# Altium schematic sheet Sheet1.SchDoc
size A2
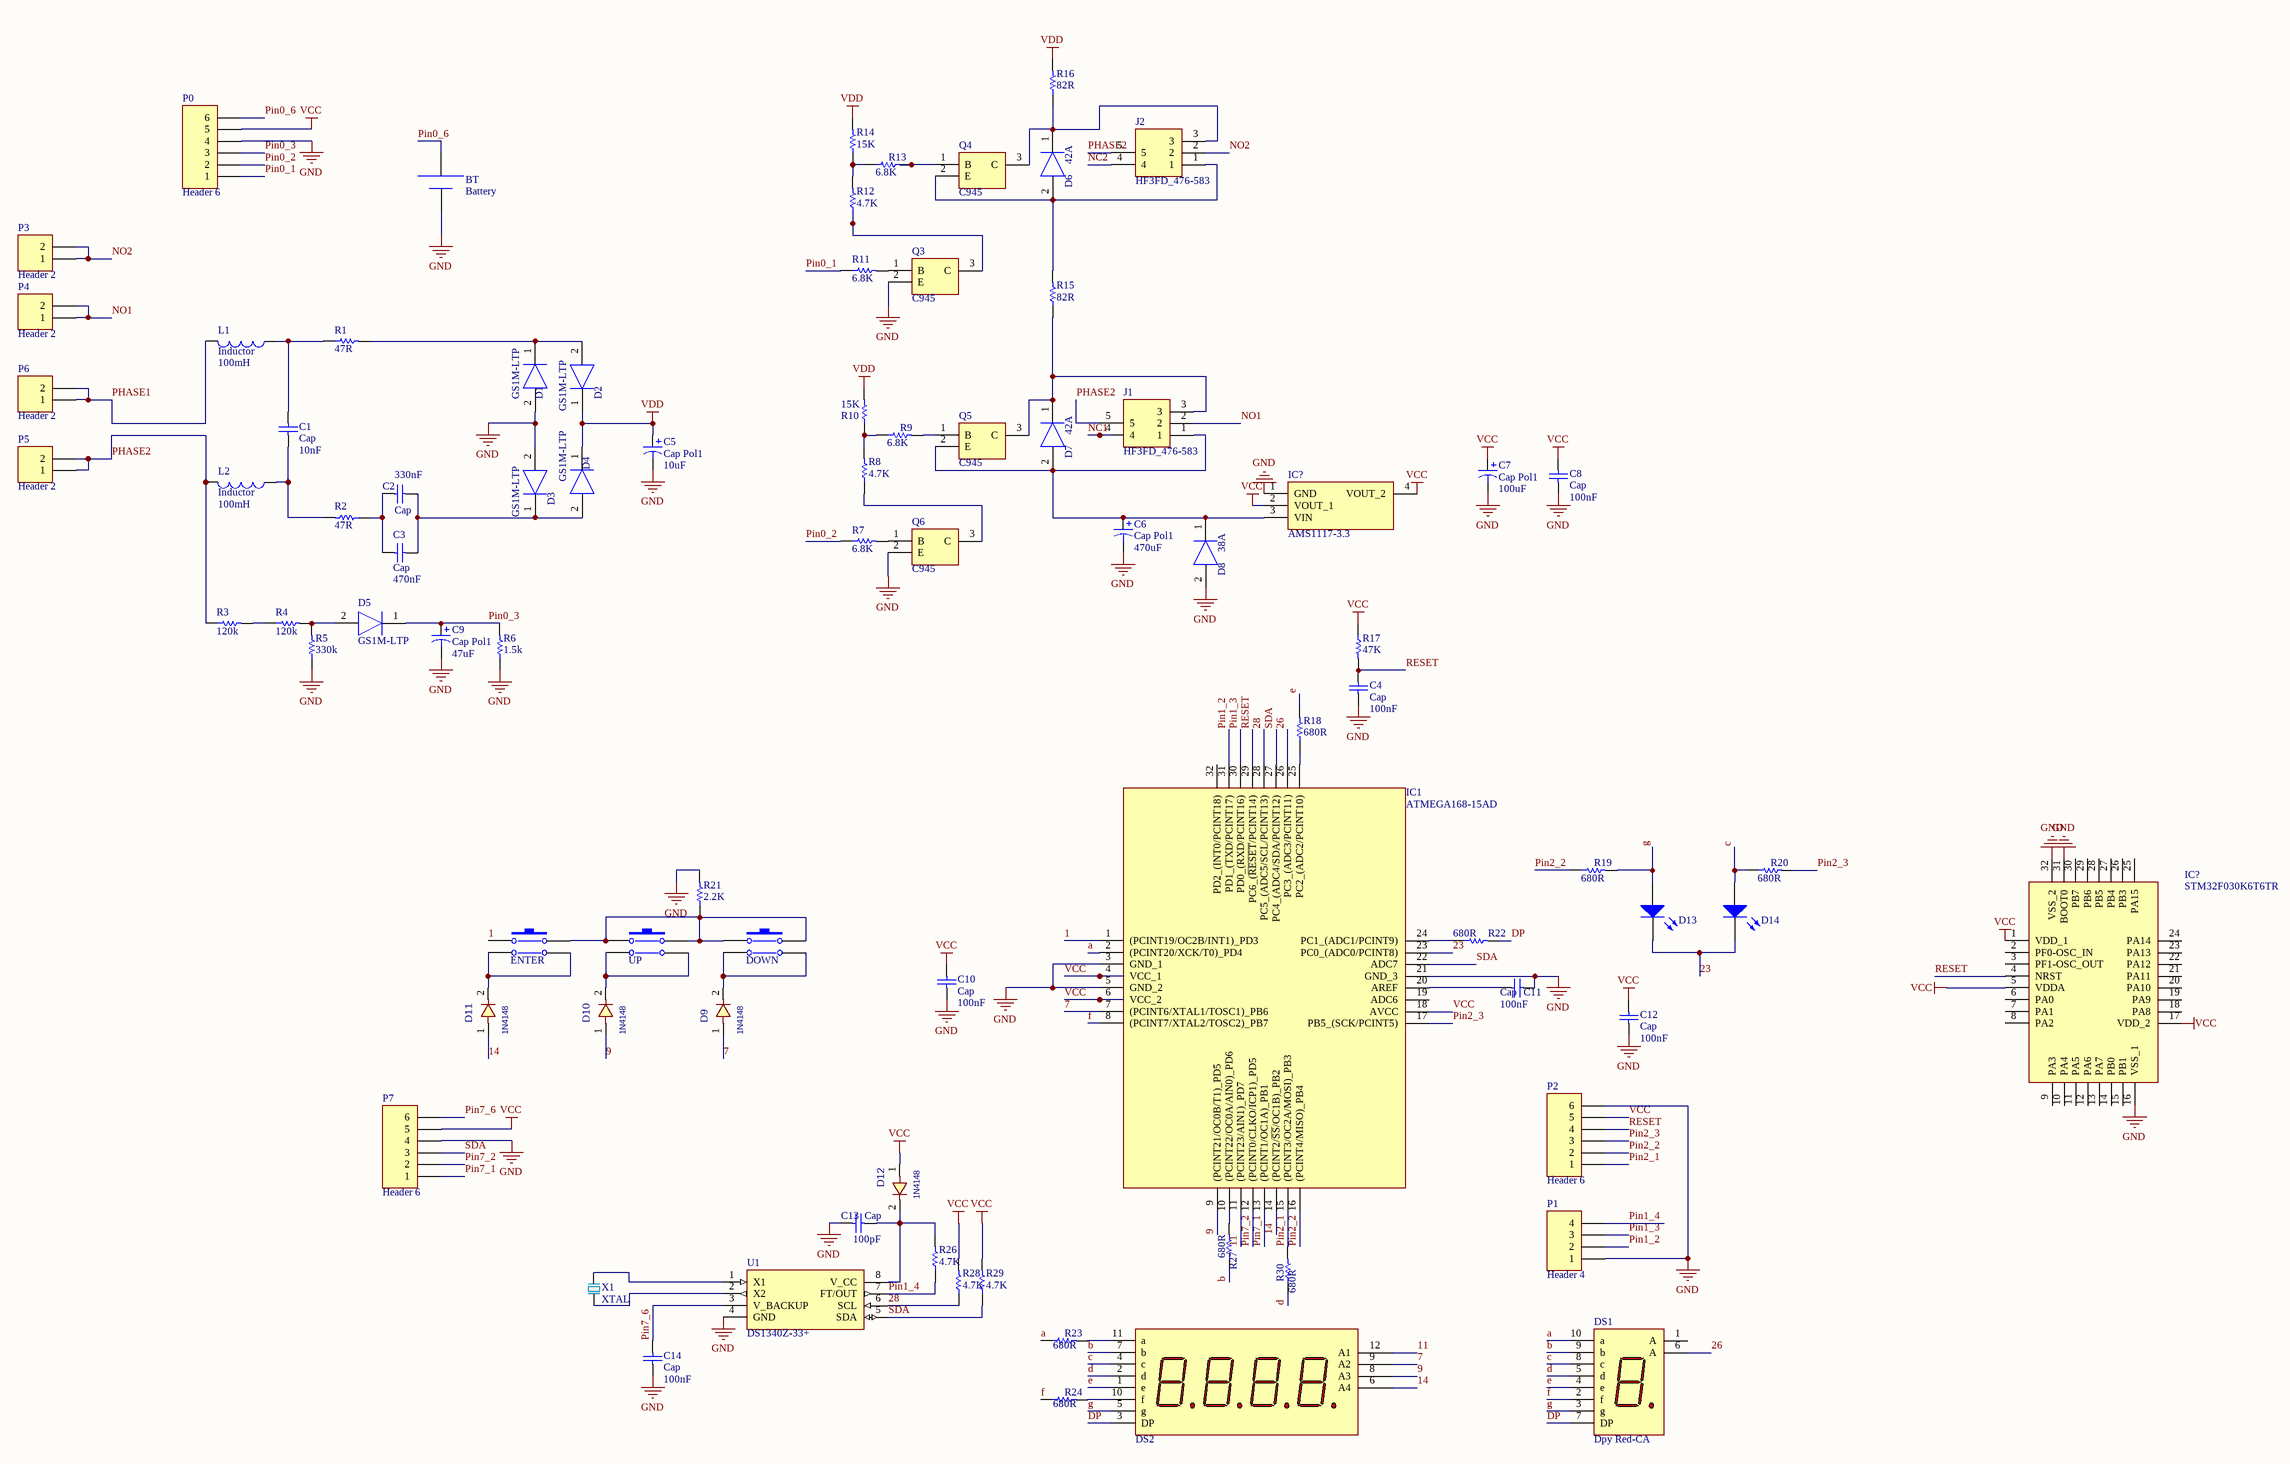
[diagram p0: Sheet1.SchDoc]

## Parts
(Parts that share a designator on the sheet are numbered #1, #2 ... from top to bottom, then left to right.)
BT  Battery  [CR2032]
C1  Cap  value 10nF  [0.47uf 400v]
C2  Cap  value 330nF  [1uf 400v]
C3  Cap  value 470nF  [1uf 400v]
C4  Cap  value 100nF  [1206]
C5  Cap Pol1  value 10uF  [CAPPR2-5x6.8]
C6  Cap Pol1  value 470uF  [CAPPR5-5x5]
C7  Cap Pol1  value 100uF  [CAPPR2-5x6.8]
C8  Cap  value 100nF  [1206]
C9  Cap Pol1  value 47uF  [CAPPR2-5x6.8]
C10  Cap  value 100nF  [1206]
C11  Cap  value 100nF  [1206]
C12  Cap  value 100nF  [1206]
C13  Cap  value 100pF  [1206]
C14  Cap  value 100nF  [1206]
D1  GS1M-LTP  [DIOM5226X244N]
D2  GS1M-LTP  [DIOM5226X244N]
D3  GS1M-LTP  [DIOM5226X244N]
D4  GS1M-LTP  [DIOM5226X244N]
D5  GS1M-LTP  [DIOM5226X244N]
D6  42A  [DIOM5226X244N]
D7  42A  [DIOM5226X244N]
D8  38A  [DIOM5226X244N]
D9  1N4148  [D_SOD80]
D10  1N4148  [D_SOD80]
D11  1N4148  [D_SOD80]
D12  1N4148  [D_SOD80]
D13  LED 5mm  [LED-1]  (value not drawn)
D14  LED 5mm  [LED-1]  (value not drawn)
DOWN  PB-4pin  [PB-4pin]  (value not drawn)
DS1  Dpy Red-CA  [LEDDIP-10/C5.08RHD]
DS2  7Segment-4Digit-CA  [7segCA]  (value not drawn)
ENTER  PB-4pin  [PB-4pin]  (value not drawn)
IC1  ATMEGA168-15AD  [QFP80P900X900X120-32N]
IC?#1  AMS1117-3.3  [SOT229P700X180-4N]
IC?#2  STM32F030K6T6TR  [QFP80P900X900X160-32N]
J1  HF3FD_476-583  [HF3FD]
J2  HF3FD_476-583  [HF3FD]
L1  Inductor  value 100mH  [AXIAL-0.3]
L2  Inductor  value 100mH  [AXIAL-0.3]
P0  Header 6  [HDR1X6]
P1  Header 4  [HDR1X4]
P2  Header 6  [HDR1X6]
P3  Header 2  [HDR1X2]
P4  Header 2  [HDR1X2]
P5  Header 2  [HDR1X2]
P6  Header 2  [HDR1X2]
P7  Header 6  [HDR1X6]
Q3  C945  [SOT95P240X110-3N]
Q4  C945  [SOT95P240X110-3N]
Q5  C945  [SOT95P240X110-3N]
Q6  C945  [SOT95P240X110-3N]
R1  47R  [RAD-0.1]
R2  47R  [RAD-0.1]
R3  120k  [1206]
R4  120k  [1206]
R5  330k  [1206]
R6  1.5k  [1206]
R7  6.8K  [1206]
R8  4.7K  [1206]
R9  6.8K  [1206]
R10  15K  [1206]
R11  6.8K  [1206]
R12  4.7K  [1206]
R13  6.8K  [1206]
R14  15K  [1206]
R15  82R  [RAD-0.1]
R16  82R  [RAD-0.1]
R17  47K  [1206]
R18  680R  [1206]
R19  680R  [1206]
R20  680R  [1206]
R21  2.2K  [1206]
R22  680R  [1206]
R23  680R  [1206]
R24  680R  [1206]
R26  4.7K  [1206]
R27  680R  [1206]
R28  4.7K  [1206]
R29  4.7K  [1206]
R30  680R  [1206]
U1  DS1340Z-33+  [SOIC127P600X175-8N]
UP  PB-4pin  [PB-4pin]  (value not drawn)
X1  XTAL  [XTAL2]

## Nets
GND: BT.1(-) C4.1 C5.2 C6.2 C7.2 C8.1 C9.2 C10.1 C11.1 C12.1 C13.2 C14.1 D1.2(A) D3.2(A) D8.2(A) IC1.3(GND_1) IC1.5(GND_2) IC1.21(GND_3) IC?#1.1(GND) IC?#2.16(VSS_1) IC?#2.31(BOOT0) IC?#2.32(VSS_2) P0.4 P1.1 P2.6 P7.4 Q3.2(E) Q6.2(E) R5.1 R6.1 R21.2 U1.4(GND)
VCC: C7.1 C8.2 C10.2 C12.2 D12.1 IC1.4(VCC_1) IC1.6(VCC_2) IC1.18(AVCC) IC?#1.2(VOUT_1) IC?#1.4(VOUT_2) IC?#2.1(VDD_1) IC?#2.5(VDDA) IC?#2.17(VDD_2) P0.5 P2.5 P7.5 R17.1 R28.2 R29.2
VDD: C5.1 D2.1(K) D4.1(K) R10.2 R14.2 R16.2
1: ENTER.1 IC1.1((PCINT19/OC2B/INT1)_PD3)
7: D9.1 DS2.9(A2) IC1.7((PCINT6/XTAL1/TOSC1)_PB6)
9: D10.1 DS2.8(A3) IC1.9((PCINT21/OC0B/T1)_PD5)
11: DS2.12(A1) IC1.11((PCINT23/AIN1)_PD7)
14: D11.1 DS2.6(A4) IC1.14((PCINT2/~{SS}/OC1B)_PB2)
23: D13.2(K) D14.2(K) IC1.23(PC0_(ADC0/PCINT8))
26: DS1.6(A) IC1.26(PC3_(ADC3/PCINT11))
28: IC1.28(PC5_(ADC5/SCL/PCINT13)) R28.1 U1.6(SCL)
a: DS1.10(a) IC1.2((PCINT20/XCK/T0)_PD4) R23.1
b: DS1.9(b) DS2.7(b) R27.1
c: D14.1(A) DS1.8(c) DS2.4(c) R20.1
d: DS1.5(d) DS2.2(d) R30.1
DP: DS1.7(DP) DS2.3(DP) R22.2
e: DS1.4(e) DS2.1(e) R18.2
f: DS1.2(f) IC1.8((PCINT7/XTAL2/TOSC2)_PB7) R24.1
g: D13.1(A) DS1.3(g) DS2.5(g) R19.2
NC1: J1.4
NC2: J2.4
NO1: J1.2 P4.1 P4.2
NO2: J2.2 P3.1 P3.2
PHASE1: L1.2 P6.1 P6.2
PHASE2: J1.5 J2.5 L2.2 P5.1 P5.2 R3.1
Pin0_1: P0.1 R11.1
Pin0_2: P0.2 R7.1
Pin0_3: C9.1 D5.1(K) P0.3 R6.2
Pin0_6: BT.0(+) P0.6
Pin1_2: IC1.31(PD1_(TXD/PCINT17)) P1.2
Pin1_3: IC1.30(PD0_(RXD/PCINT16)) P1.3
Pin1_4: P1.4 R26.1 U1.7(FT/OUT)
Pin2_1: IC1.15((PCINT3/OC2A/MOSI)_PB3) P2.1 R30.2
Pin2_2: IC1.16((PCINT4/MISO)_PB4) P2.2 R19.1
Pin2_3: IC1.17(PB5_(SCK/PCINT5)) P2.3 R20.2
Pin7_1: IC1.13((PCINT1/OC1A)_PB1) P7.1
Pin7_2: IC1.12((PCINT0/CLKO/ICP1)_PD5) P7.2
Pin7_6: C14.2 P7.6 U1.3(V_BACKUP)
RESET: C4.2 IC1.29(PC6_(~{RESET}/PCINT14)) IC?#2.4(NRST) P2.4 R17.2
SDA: IC1.22(ADC7) IC1.27(PC4_(ADC4/SDA/PCINT12)) P7.3 R29.1 U1.5(SDA)
NetC1_1: C1.1 L2.1 R2.2
NetC1_2: C1.2 L1.1 R1.1
NetC2_1: C2.1 C3.2 R2.1
NetC2_2: C2.2 C3.1 D3.1(K) D4.2(A)
NetC6_1: C6.1 D7.2(A) D8.1(K) IC?#1.3(VIN) J1.1 Q5.2(E)
NetC11_2: C11.2 IC1.20(AREF)
NetC13_1: C13.1 D12.2 R26.2 U1.8(V_CC)
NetD1_1: D1.1(K) D2.2(A) R1.2
NetD5_2: D5.2(A) R4.2 R5.2
NetD6_1: D6.1(K) J2.3 Q4.3(C) R16.1
NetD6_2: D6.2(A) J2.1 Q4.2(E) R15.2
NetD7_1: D7.1(K) J1.3 Q5.3(C) R15.1
NetD9_2: D9.2 DOWN.3 DOWN.4
NetD10_2: D10.2 UP.3 UP.4
NetD11_2: D11.2 ENTER.3 ENTER.4
NetDOWN_1: DOWN.1 DOWN.2 ENTER.2 R21.1 UP.1 UP.2
NetDS2_10: DS2.10(f) R24.2
NetDS2_11: DS2.11(a) R23.2
NetIC1_10: IC1.10((PCINT22/OC0A/AIN0)_PD6) R27.2
NetIC1_24: IC1.24(PC1_(ADC1/PCINT9)) R22.1
NetIC1_25: IC1.25(PC2_(ADC2/PCINT10)) R18.1
NetQ3_1: Q3.1(B) R11.2
NetQ3_3: Q3.3(C) R12.1
NetQ4_1: Q4.1(B) R13.2
NetQ5_1: Q5.1(B) R9.2
NetQ6_1: Q6.1(B) R7.2
NetQ6_3: Q6.3(C) R8.1
NetR3_2: R3.2 R4.1
NetR8_2: R8.2 R9.1 R10.1
NetR12_2: R12.2 R13.1 R14.1
NetU1_1: U1.1(X1) X1.1
NetU1_2: U1.2(X2) X1.2

Not connected (* = marked no-connect by the designer): DS1 1(A); IC1 19(ADC6) 32(PD2_(INT0/PCINT18)); IC?#2 2(PF0-OSC_IN) 3(PF1-OSC_OUT) 6(PA0) 7(PA1) 8(PA2) 9(PA3) 10(PA4) 11(PA5) 12(PA6) 13(PA7) 14(PB0) 15(PB1) 18(PA8) 19(PA9) 20(PA10) 21(PA11) 22(PA12) 23(PA13) 24(PA14) 25(PA15) 26(PB3) 27(PB4) 28(PB5) 29(PB6) 30(PB7)

## Library data of the parts
BT = Battery holder: Battery holder CR2032; Designer: Seyed Mohsen Ghasemian; E-mail: picpars@gmail.com; ComponentLinkURL: www.picpars.com; Make: 02/12/2011
C1-C4 C8 C10-C14 = Cap: Capacitor; Published: 8-Jun-2000; LatestRevisionDate: 17-Jul-2002; LatestRevisionNote: Re-released for DXP Platform.; PackageReference: RAD-0.3; Publisher: Altium Limited; PackageDescription: Radial Cap, Thru-Hole; 2 Leads; 0.3 in Pin Spacing
C5-C7 C9 = Cap Pol1: Polarized Capacitor (Radial); Published: 8-Jun-2000; LatestRevisionDate: 17-Jul-2002; LatestRevisionNote: Re-released for DXP Platform.; PackageReference: RB7.6-15; Publisher: Altium Limited; PackageDescription: Polarized Capacitor (Radial); 2 Leads
D1-D8 = GS1M-LTP: Diode; Manufacturer_Name: Micro Commercial Components (MCC); Datasheet Link: https://componentsearchengine.com/Datasheets/2/GS1M-LTP.pdf; Height: 2.44mm; Manufacturer_Part_Number: GS1M-LTP; Arrow Part Number: GS1M-LTP; Arrow Price/Stock: https://www.arrow.com/en/products/gs1m-ltp/micro-commercial-components; Mouser Part Number: 833-GS1M-LTP; Mouser Price/Stock: https://www.mouser.co.uk/ProductDetail/Micro-Commercial-Components-MCC/GS1M-LTP?qs=SdqRYZZ9IxCJVysXrjUefQ%3D%3D
D9-D12 = DIODE_SMD_1N4148: DIODE, FAST SWTICHING, 0.3A, 0.5W; DESC: DESCRIPTION; PARAM: 75V; PARAM2: 300mA, 0.5W; MANF: MANF; ASSEMBLY: ASSEMBLY; PRICE: PRICE; MANF_P#: 1N4148; VALUE: 1N4148
D13 D14 = LED 5mm: Typical LED; Designer: Seyed Mohsen Ghasemian; Published: 07/31/2012; PackageReference: LED; Publisher: www.picpars.com; PackageDescription: LED; 2 Leads
DOWN ENTER UP = PB-4pin: Switch; E-mail: picpars@gmail.com; Designer: Seyed Mohsen Ghasemian; Publisher: www.picpars.com; WEB: www.picpars.com
DS1 = Dpy Red-CA: 7.62 mm Black Surface HER 7-Segment Display: CA, RH DP; MinimumIntensity: 360 ucd; Note: IF = 5 mA; Colour: High Efficiency Red (HER); Note: Pins 1 and 6 are redundant Anodes.; Published: 8-Jun-2000; LatestRevisionDate: 17-Dec-2003; LatestRevisionNote: Schematic revised, PCB Footprint replaced.; DatasheetVersion: 19-Feb-2002; PackageVersion: 19-Feb-2002; PackageReference: LEDDIP-10; Publisher: Altium Limited; ComponentLink1Description: Manufacturer Link; ComponentLink1URL: http://www.agilent.com/
DS2 = 7Seg-4Digit-CA: 7-Segment Display: CA; Colour: Read; Designer: Seyed Mohsen Ghasemain; Published: 07/31/2012; Publisher: www.picpars.com; ComponentLink1URL: http://www.picpars.com/
IC1 = ATMEGA168-15AD: Integrated Circuit; Manufacturer_Name: Microchip; Datasheet Link: https://componentsearchengine.com/Datasheets/2/ATMEGA168-15AD.pdf; Height: 1.2mm; Manufacturer_Part_Number: ATMEGA168-15AD; Mouser Part Number: 556-ATMEGA168-15AD; Mouser Price/Stock: https://www.mouser.com/Search/Refine.aspx?Keyword=556-ATMEGA168-15AD
IC?#1 = AMS1117-3.3: Integrated Circuit; Manufacturer_Name: Advanced Monolithic Systems; Datasheet Link: http://www.advanced-monolithic.com/pdf/ds1117.pdf; Height: 1.8mm; Manufacturer_Part_Number: AMS1117-3.3
IC?#2 = STM32F030K6T6TR: Integrated Circuit; Manufacturer_Name: STMicroelectronics; Datasheet Link: http://www.st.com/content/ccc/resource/technical/document/datasheet/a4/5d/0b/0e/87/c4/4d/71/DM00088500.pdf/files/DM00088500.pdf/jcr:content/translations/en.DM00088500.pdf; Height: 1.6mm; Manufacturer_Part_Number: STM32F030K6T6TR; Mouser Part Number: 511-STM32F030K6T6TR; Mouser Price/Stock: https://www.mouser.co.uk/ProductDetail/STMicroelectronics/STM32F030K6T6TR?qs=9MuLHSklicort60U4QZudQ%3D%3D; Arrow Part Number: STM32F030K6T6TR; Arrow Price/Stock: https://www.arrow.com/en/products/stm32f030k6t6tr/stmicroelectronics
J1 J2 = HF3FD_476-583: Connector; Manufacturer_Name: RS Components; Manufacturer_Part_Number: HF3FD 476-583; Datasheet Link: http://it.rs-online.com/web/p/rele-monostabili/0476583/
L1 L2 = Inductor: Code_IEC: 1005; Published: 8-Jun-2000; LatestRevisionDate: 29-May-2009; LatestRevisionNote: IPC-7351 Footprint Added.; PackageReference: 0402-A; Publisher: Altium Limited; PackageDescription: Chip Inductor; Code_JEITA: 0402
P0 P2 P7 = Header 6: Header, 6-Pin; LatestRevisionDate: 17-Jul-2002; LatestRevisionNote: Re-released for DXP Platform.; Publisher: Altium Limited
P1 = Header 4: Header, 4-Pin; LatestRevisionDate: 17-Jul-2002; LatestRevisionNote: Re-released for DXP Platform.; Publisher: Altium Limited
P3-P6 = Header 2: Header, 2-Pin; LatestRevisionDate: 17-Jul-2002; LatestRevisionNote: Re-released for DXP Platform.; Publisher: Altium Limited
Q3-Q6 = C945: Transistor; Manufacturer_Name: Shikues; Datasheet Link: https://datasheet.lcsc.com/szlcsc/2001131004_Shikues-C945_C475659.pdf; Height: 1.1mm; Manufacturer_Part_Number: C945
R1-R6 = RES Axial 3W: Designer: Abbas Basereh; Desc.: RES Axial 3W; Data: 4-1-2017
R7-R24 R26-R30 = RES 0805 0.125W: RES 0805; Designer: Abbas Basereh; Desc.: RES SMD 0805; Data: 16-12-2016
U1 = DS1340Z-33+: Undefined or Miscellaneous; Manufacturer_Name: Maxim Integrated; Datasheet Link: https://componentsearchengine.com/Datasheets/2/DS1340Z-33+.pdf; Height: 1.75mm; Manufacturer_Part_Number: DS1340Z-33+; Mouser Part Number: 700-DS1340Z-33; Mouser Price/Stock: https://www.mouser.co.uk/ProductDetail/Maxim-Integrated/DS1340Z-33%2b?qs=0Y9aZN%252BMVCUptkgl4y27CA%3D%3D